# EasyEDA schematic Shield_Amir_3xA4988_V_2.json
TITLE: Connector for Shield V4; REV: 1.0; Date: 2023-07-23; Sheet: 1/1; Company: Amir BS
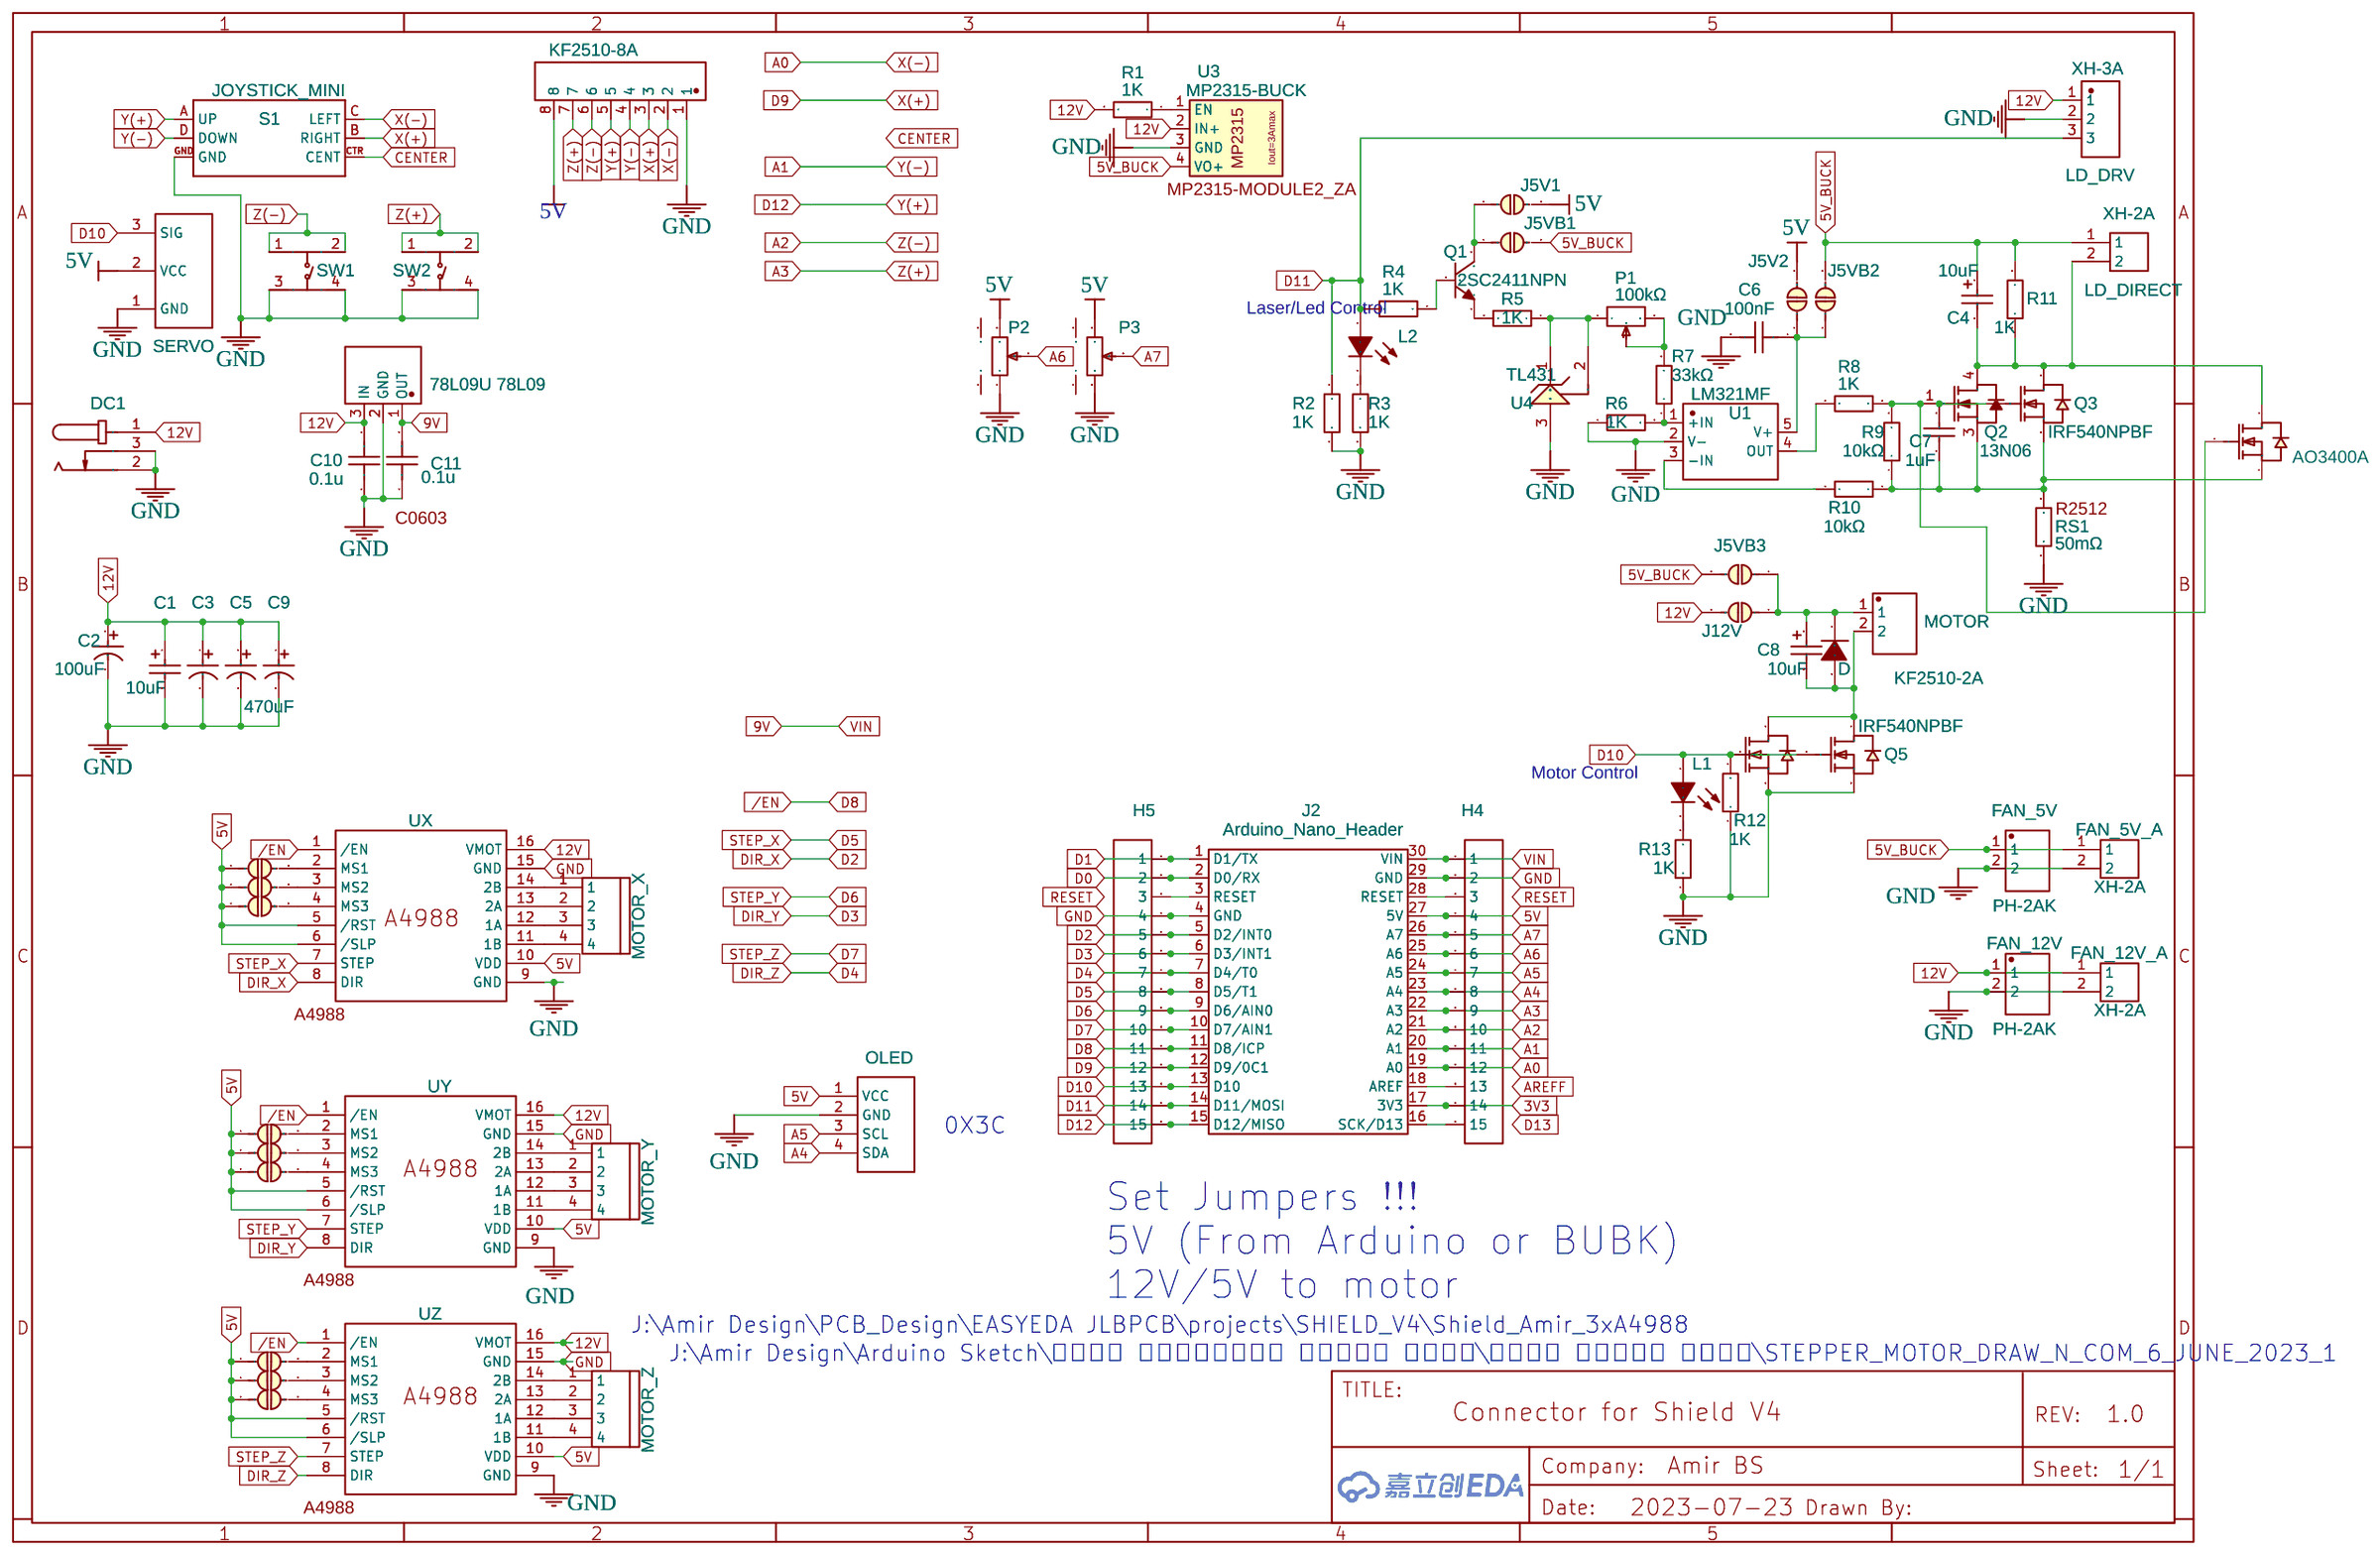
[diagram p0: schematic sheet]

## Parts
C1  10uF  [CAP-SMD_L3.2-W1.6-RD-C7171]
C2  100uF  [CAP-TH_BD6.3-P2.50-D1.0-FD]
C3  470uF  [CAP-TH_BD8.0-P3.50-D0.6-FD]
C4  10uF  [CAP-SMD_L3.2-W1.6-RD-C7171]
C5  470uF  [CAP-TH_BD8.0-P3.50-D0.6-FD]
C6  100nF  [C0603]
C7  1uF  [C0603]
C8  10uF  [CAP-SMD_L3.2-W1.6-RD-C7171]
C9  470uF  [CAP-TH_BD8.0-P3.50-D0.6-FD]
C10  0.1u  [C0603]
C11  0.1u  [C0603]
CN2  KF2510-8A  [CONN-TH_8P-P2.54_KF2510-8A]
D  1N4007  [SMAF_L3.5-W2.6-LS4.7-RD]
DC1  DC  [DC-IN-TH_DC005]
FAN_5V  PH-2AK  [CONN-TH_PH-2A]
FAN_5V_A  XH-2A  [CONN-TH_XH-2A]
FAN_12V  PH-2AK  [CONN-TH_PH-2A]
FAN_12V_A  XH-2A  [CONN-TH_XH-2A]
H4  HDR-F-2.54_1x15  [HDR-F-2.54_1X15]
H5  HDR-F-2.54_1x15  [HDR-F-2.54_1X15]
J2  Arduino_Nano_Header  [DIP-30_L43.18-W15.24-ARDUINONANO]
J5V1  JUMPER-SMT_2  [JUMPERS_SMT-JUMPER_2_NC_PASTE_NO-SILK]
J5V2  JUMPER-SMT_2  [JUMPERS_SMT-JUMPER_2_NC_PASTE_NO-SILK]
J5VB1  JUMPER-SMT_2  [JUMPERS_SMT-JUMPER_2_NC_PASTE_NO-SILK]
J5VB2  JUMPER-SMT_2  [JUMPERS_SMT-JUMPER_2_NC_PASTE_NO-SILK]
J5VB3  JUMPER-SMT_2  [JUMPERS_SMT-JUMPER_2_NC_PASTE_NO-SILK]
J12V  JUMPER-SMT_2  [JUMPERS_SMT-JUMPER_2_NC_PASTE_NO-SILK]
JX1  JUMPER-SMT_2  [JUMPERS_SMT-JUMPER_2_NC_PASTE_NO-SILK]
JX2  JUMPER-SMT_2  [JUMPERS_SMT-JUMPER_2_NC_PASTE_NO-SILK]
JX3  JUMPER-SMT_2  [JUMPERS_SMT-JUMPER_2_NC_PASTE_NO-SILK]
JY1  JUMPER-SMT_2  [JUMPERS_SMT-JUMPER_2_NC_PASTE_NO-SILK]
JY2  JUMPER-SMT_2  [JUMPERS_SMT-JUMPER_2_NC_PASTE_NO-SILK]
JY3  JUMPER-SMT_2  [JUMPERS_SMT-JUMPER_2_NC_PASTE_NO-SILK]
JZ1  JUMPER-SMT_2  [JUMPERS_SMT-JUMPER_2_NC_PASTE_NO-SILK]
JZ2  JUMPER-SMT_2  [JUMPERS_SMT-JUMPER_2_NC_PASTE_NO-SILK]
JZ3  JUMPER-SMT_2  [JUMPERS_SMT-JUMPER_2_NC_PASTE_NO-SILK]
L1  LED  [LED0603-R-RD_BLUE]
L2  LED  [LED0603-R-RD_BLUE]
LD_DIRECT  XH-2A  [CONN-TH_XH-2A]
LD_DRV  XH-3A  [CONN-TH_XH-3A]
MOTOR  KF2510-2A  [CONN-TH_KF2510-2A]
MOTOR_X  XH2.54-4AW  [CONN-TH_XH2.54-4AW]
MOTOR_Y  XH2.54-4AW  [CONN-TH_XH2.54-4AW]
MOTOR_Z  XH2.54-4AW  [CONN-TH_XH2.54-4AW]
OLED  1.3 inch OLED SSH1106 I2C 128x64 copy  [1.3_OLED_SSH1106_I2C_128X64_BOARD]
P1  100kΩ  [RES-ADJ-TH_3296W]
P2  长柄旋转电位器  [RES-ADJ-TH_RV09]
P3  长柄旋转电位器  [RES-ADJ-TH_RV09]
Q1  2SC2411NPN  [SOT-346_L2.9-W1.6-P1.90-LS2.8-TR-CW]
Q2  13N06  [DPAK_L6.5-W6.0-P2.29-LS9.9-BR]
Q3  IRF540NPBF  [TO-220-3_L10.0-W4.5-P2.54-L]
Q4  Q  [SOT-23-3_L2.9-W1.3-P1.90-LS2.4-BR]
Q5  IRF540NPBF  [TO-220-3_L10.0-W4.5-P2.54-L]
Q6  AO3400A  [SOT-23-3_L2.9-W1.6-P1.90-LS2.8-BR]
R1  1K  [R0603]
R2  1K  [R0603]
R3  1K  [R0603]
R4  1K  [R0603]
R5  1K  [R0603]
R6  1K  [R0603]
R7  33kΩ  [R0603]
R8  1K  [R0603]
R9  10kΩ  [R0603]
R10  10kΩ  [R0603]
R11  1K  [R0603]
R12  1K  [R0603]
R13  1K  [R0603]
RS1  50mΩ  [R2512]
S1  JOYSTICK_MINI  [JOYSTICK_MINI]
SERVO  Servo+3d  [SERVO+3D]
SW1  TC-6610-7-160G  [SW-TH_4P-L5.0-W5.0-P4.50-LS6.5]
SW2  TC-6610-7-160G  [SW-TH_4P-L5.0-W5.0-P4.50-LS6.5]
U1  LM321MF  [SOT-23-5_L2.9-W1.6-P0.95-LS2.8-BL]
U3  MP2315-BUCK  [MP2315-MODULE2_ZA]
U4  TL431  [SOT-23-3_L2.9-W1.3-P1.90-LS2.4-BR]
U5  78L09U 78L09  [SOT-89-3_L4.5-W2.5-P1.50-LS4.0-BR]
UX  A4988  [A4988]
UY  A4988  [A4988]
UZ  A4988  [A4988]

## Library data of the parts
C1 C4 C8 = TAJA106K016RNJ: Supplier: LCSC; Manufacturer: Kyocera AVX; Supplier Part: C7171; JLCPCB Part Class: Basic Part; Package Display: No
C2 = 100uF 35V 6.3*11: Supplier: LCSC; Manufacturer: CX(承兴); Supplier Part: C19504; JLCPCB Part Class: Extended Part; Package Display: No
C3 C5 C9 = 470uF 25V 8*12Black high frequency: Supplier: LCSC; Manufacturer: CX(承兴); Supplier Part: C44602; JLCPCB Part Class: Extended Part; Package Display: No
C6 = CC0603KRX7R9BB104: Supplier: LCSC; Manufacturer: YAGEO(国巨); Supplier Part: C14663; JLCPCB Part Class: Basic Part; Package Display: No
C7 = CL10A105KB8NNNC: Supplier: LCSC; Manufacturer: SAMSUNG(三星); Supplier Part: C15849; JLCPCB Part Class: Basic Part; Package Display: No
C10 = C_0603_US: Contributor: LCEDA_Lib; Package Display: No
C11 = C_0603_US: Contributor: LCEDA_Lib; Package Display: Yes
CN2 = KF2510-8A: Contributor: LCSC; Supplier: LCSC; Supplier Part: C503487; Manufacturer: BOOMELE(博穆精密); JLCPCB Part Class: Extended Part; Package Display: No
D = 1N4007F: Supplier: LCSC; Manufacturer: SK; Supplier Part: C110856; JLCPCB Part Class: Extended Part; Package Display: No
DC1 = DC005-2.0MM: Supplier: LCSC; Manufacturer: SOFNG; Supplier Part: C111567; Package Display: No
FAN_5V FAN_12V = PH-2AK: Supplier: LCSC; Manufacturer: BOOMELE(博穆精密); Supplier Part: C8886; JLCPCB Part Class: Extended Part; Package Display: No
FAN_5V_A FAN_12V_A LD_DIRECT = XH-2A: JLCPCB Part Class: Extended Part; Package Display: No
H4 H5 = HDR-F-2.54_1x15: Supplier Part: C124408; Supplier: LCSC; Contributor: LCEDA_Lib; Package Display: No
J2 = Arduino_Nano_Header
J5V1 J5V2 J5VB1-J5VB3 J12V JX1-JX3 JY1-JY3 JZ1-JZ3 = JUMPER-SMT_2: Contributor: P-Thomsen; Package Display: No
L1 L2 = 19-217/BHC-ZL1M2RY/3T: Supplier: LCSC; Manufacturer: EVERLIGHT; Supplier Part: C72041; JLCPCB Part Class: Basic Part; Package Display: No
LD_DRV = XH-3A_C2908601: Contributor: LCSC; JLCPCB Part Class: Extended Part; Package Display: No
MOTOR = KF2510-2A: Supplier: LCSC; Manufacturer: BOOMELE; Supplier Part: C27543; JLCPCB Part Class: Extended Part; Package Display: No
MOTOR_X MOTOR_Y MOTOR_Z = XH2.54-4AW: JLCPCB Part Class: Extended Part; Package Display: No
OLED = 1.3 inch OLED SSH1106 I2C 128x64 copy: Contributor: Deguello; Package Display: No
P1 = 3296W-1-104LF: Resistance(Ohms): 100K; JLCPCB Part Class: Extended Part; Package Display: No
P2 P3 = 长柄旋转电位器: Supplier: LCSC; Supplier Part: C2874842; Manufacturer: null; JLCPCB Part Class: Extended Part; Contributor: LCSC; Package Display: No
Q1 = 2SC2411KT146R: Contributor: LCSC; Supplier: LCSC; Supplier Part: C122622; Manufacturer: ROHM(罗姆); JLCPCB Part Class: Extended Part; Package Display: No
Q2 = FQD13N06LTM: Contributor: LCSC; Supplier: LCSC; Supplier Part: C236914; Manufacturer: onsemi(安森美); JLCPCB Part Class: Extended Part; Package Display: No
Q3 Q5 = IRF540NPBF: Supplier: LCSC; Manufacturer: Infineon(英飞凌); Supplier Part: C2566; JLCPCB Part Class: Extended Part; Package Display: No
Q4 = JSM2302: Supplier: LCSC; Supplier Part: C916403; Manufacturer: JSMSEMI; Contributor: LCSC; JLCPCB Part Class: Extended Part; Package Display: No
Q6 = AO3400A: Supplier: LCSC; Manufacturer: AOS; Supplier Part: C20917; JLCPCB Part Class: Basic Part; Package Display: No
R1-R6 R8 R11-R13 = 0603WAF1001T5E: Supplier: LCSC; Manufacturer: UniOhm; Supplier Part: C21190; JLCPCB Part Class: Basic Part; Package Display: No
R7 = 0603WAF3302T5E: JLCPCB Part Class: Basic Part; Package Display: No
R9 R10 = 0603WAF1002T5E: Supplier: LCSC; Manufacturer: UNI-ROYAL(厚声); Supplier Part: C25804; Resistance (Ohms): 10K; JLCPCB Part Class: Basic Part; Package Display: No
RS1 = CR2512F0R05E04: Contributor: LCSC; Supplier: LCSC; Supplier Part: C147122; Manufacturer: EVER OHMS(天二科技); JLCPCB Part Class: Extended Part; Package Display: Yes
S1 = JOYSTICK_MINI: Small 5-way tactile joystick, COM-10063; Contributor: SparkFun; Package Display: No
SERVO = Servo+3d: Manufacturer Part: New SchematicLib; Contributor: pjsg; Package Display: No
SW1 SW2 = TC-6610-7-160G: Contributor: LCSC; Supplier: LCSC; Supplier Part: C2845252; Manufacturer: HCTL(华灿天禄); JLCPCB Part Class: Extended Part; Package Display: No
U1 = LM321MF: Contributor: LCSC; Supplier: LCSC; Supplier Part: C668208; Manufacturer: UMW(广东友台半导体); JLCPCB Part Class: Extended Part; Package Display: No
U3 = MP2315-BUCK: Supplier: FatimaTech; Contributor: zainul.aabdin; Package Display: Yes
U4 = TL431BIDBZR: Supplier: LCSC; Manufacturer: TI(德州仪器); Supplier Part: C41283; JLCPCB Part Class: Extended Part; Package Display: No
U5 = 78L09U 78L09: Contributor: LCSC; Supplier: LCSC; Supplier Part: C2875177; Manufacturer: CBI(创基); JLCPCB Part Class: Extended Part; Package Display: No
UX UY UZ = A4988: Contributor: unaja_closp; Package Display: Yes

## Nets
3V3: H4.14 J2.17(3V3)
5V: CN2.8 H4.4 J2.27(5V) J5V1.2 J5V2.2 JX1.1 JX2.1 JX3.1 JY1.1 JY2.1 JY3.1 JZ1.1 JZ2.1 JZ3.1 OLED.1(VCC) P2.3 P3.3 SERVO.2(VCC) UX.5(/RST) UX.6(/SLP) UX.10(VDD) UY.5(/RST) UY.6(/SLP) UY.10(VDD) UZ.5(/RST) UZ.6(/SLP) UZ.10(VDD)
5V_BUCK: C4.1 FAN_5V.1 FAN_5V_A.1 J5VB1.2 J5VB2.2 J5VB3.2 LD_DIRECT.1 R11.2 U3.4(VO+)
9V: C11.2 H4.1 J2.30(VIN) U5.1(OUT)
12V: C1.1 C2.1 C3.1 C5.1 C9.1 C10.2 DC1.1 FAN_12V.1 FAN_12V_A.1 J12V.2 LD_DRV.1 R1.2 U3.2(IN+) U5.3(IN) UX.16(VMOT) UY.16(VMOT) UZ.16(VMOT)
GND: C1.2 C2.2 C3.2 C5.2 C6.2 C9.2 C10.1 C11.1 CN2.1 DC1.2 DC1.3 FAN_5V.2 FAN_5V_A.2 FAN_12V.2 FAN_12V_A.2 H4.2 H5.4 J2.4(GND) J2.29(GND) LD_DRV.2 OLED.2(GND) P2.1 P3.1 Q4.2(S) Q5.3(S) R2.2 R3.2 R6.1 R12.1 R13.1 RS1.1 S1.GND SERVO.1(GND) SW1.3 SW1.4 SW2.3 SW2.4 U1.2(V-) U3.3(GND) U4.3(ANODE) U5.2(GND) UX.9(GND) UX.15(GND) UY.9(GND) UY.15(GND) UZ.9(GND) UZ.15(GND)
/EN: H5.11 J2.11(D8/ICP) UX.1(/EN) UY.1(/EN) UZ.1(/EN)
A0: CN2.2 H4.12 J2.19(A0) S1.C(LEFT)
A1: CN2.4 H4.11 J2.20(A1) S1.D(DOWN)
A2: CN2.6 H4.10 J2.21(A2) SW1.1 SW1.2
A3: CN2.7 H4.9 J2.22(A3) SW2.1 SW2.2
A4: H4.8 J2.23(A4) OLED.4(SDA)
A5: H4.7 J2.24(A5) OLED.3(SCL)
A6: H4.6 J2.25(A6) P2.2
A7: H4.5 J2.26(A7) P3.2
CENTER: S1.CTR(CENT)
D0: H5.2 J2.2(D0/RX)
D1: H5.1 J2.1(D1/TX)
D2: H5.5 J2.5(D2/INT0) UX.8(DIR)
D3: H5.6 J2.6(D3/INT1) UY.8(DIR)
D4: H5.7 J2.7(D4/T0) UZ.8(DIR)
D5: H5.8 J2.8(D5/T1) UX.7(STEP)
D6: H5.9 J2.9(D6/AIN0) UY.7(STEP)
D7: H5.10 J2.10(D7/AIN1) UZ.7(STEP)
D9: CN2.3 H5.12 J2.12(D9/0C1) S1.B(RIGHT)
D10: H5.13 J2.13(D10) L1.1(A) Q4.1(G) Q5.1(G) R12.2 SERVO.3(SIG)
D11: H5.14 J2.14(D11/MOSI) L2.1(A) LD_DRV.3 R2.1 R4.1
D12: CN2.5 H5.15 J2.15(D12/MISO) S1.A(UP)
Net-(C4-2): C4.2 LD_DIRECT.2 Q2.4(D) Q3.2(D) Q6.3(D) R11.1
Net-(C6-1): C6.1 J5V2.1 J5VB2.1 U1.5(V+)
Net-(C7-1): C7.1 Q2.3(S) Q3.3(S) Q6.2(S) R9.1 R10.1 RS1.2
Net-(C7-2): C7.2 Q2.1(G) Q3.1(G) Q6.1(G) R8.1 R9.2
Net-(C8-1): C8.1 D.1(C) J5VB3.1 J12V.1 MOTOR.1
Net-(C8-2): C8.2 D.2(A) MOTOR.2 Q4.3(D) Q5.2(D)
Net-(H4-3): H4.3 J2.28(RESET)
Net-(H4-13): H4.13 J2.18(AREF)
Net-(H4-15): H4.15 J2.16(SCK/D13)
Net-(H5-3): H5.3 J2.3(RESET)
Net-(J5V1-1): J5V1.1 J5VB1.1 Q1.3(C)
Net-(JX1-2): JX1.2 UX.2(MS1)
Net-(JX2-2): JX2.2 UX.3(MS2)
Net-(JX3-2): JX3.2 UX.4(MS3)
Net-(JY1-2): JY1.2 UY.2(MS1)
Net-(JY2-2): JY2.2 UY.3(MS2)
Net-(JY3-2): JY3.2 UY.4(MS3)
Net-(JZ1-2): JZ1.2 UZ.2(MS1)
Net-(JZ2-2): JZ2.2 UZ.3(MS2)
Net-(JZ3-2): JZ3.2 UZ.4(MS3)
Net-(L1-2): L1.2(C) R13.2
Net-(L2-2): L2.2(C) R3.1
Net-(MOTOR_X-1): MOTOR_X.1 UX.14(2B)
Net-(MOTOR_X-2): MOTOR_X.2 UX.13(2A)
Net-(MOTOR_X-3): MOTOR_X.3 UX.12(1A)
Net-(MOTOR_X-4): MOTOR_X.4 UX.11(1B)
Net-(MOTOR_Y-1): MOTOR_Y.1 UY.14(2B)
Net-(MOTOR_Y-2): MOTOR_Y.2 UY.13(2A)
Net-(MOTOR_Y-3): MOTOR_Y.3 UY.12(1A)
Net-(MOTOR_Y-4): MOTOR_Y.4 UY.11(1B)
Net-(MOTOR_Z-1): MOTOR_Z.1 UZ.14(2B)
Net-(MOTOR_Z-2): MOTOR_Z.2 UZ.13(2A)
Net-(MOTOR_Z-3): MOTOR_Z.3 UZ.12(1A)
Net-(MOTOR_Z-4): MOTOR_Z.4 UZ.11(1B)
Net-(P1-1): P1.1 R5.1 U4.1(CATHODE) U4.2(REF)
Net-(P1-2): P1.2 P1.3 R7.2
Net-(Q1-1): Q1.1(E) R5.2
Net-(Q1-2): Q1.2(B) R4.2
Net-(R1-1): R1.1 U3.1(EN)
Net-(R6-2): R6.2 R7.1 U1.1(+IN)
Net-(R8-2): R8.2 U1.4(OUT)
Net-(R10-2): R10.2 U1.3(-IN)

Not connected (* = marked no-connect by the designer): P2 4 5; P3 4 5

## Notes on the sheet
- Laser/Led Control
- Motor Control
- 0X3C
- Set Jumpers !!!
  5V (From Arduino or BUBK)
  12V/5V to motor
- J:\Amir Design\PCB_Design\EASYEDA JLBPCB\projects\SHIELD_V4\Shield_Amir_3xA4988
- J:\Amir Design\Arduino Sketch\קודי ארדווינו למנוע סטפר\בודק מנועי סטפר\STEPPER_MOTOR_DRAW_N_COM_6_JUNE_2023_1
